# EAGLE design optoisolator-shield (EAGLE 6.5.0)
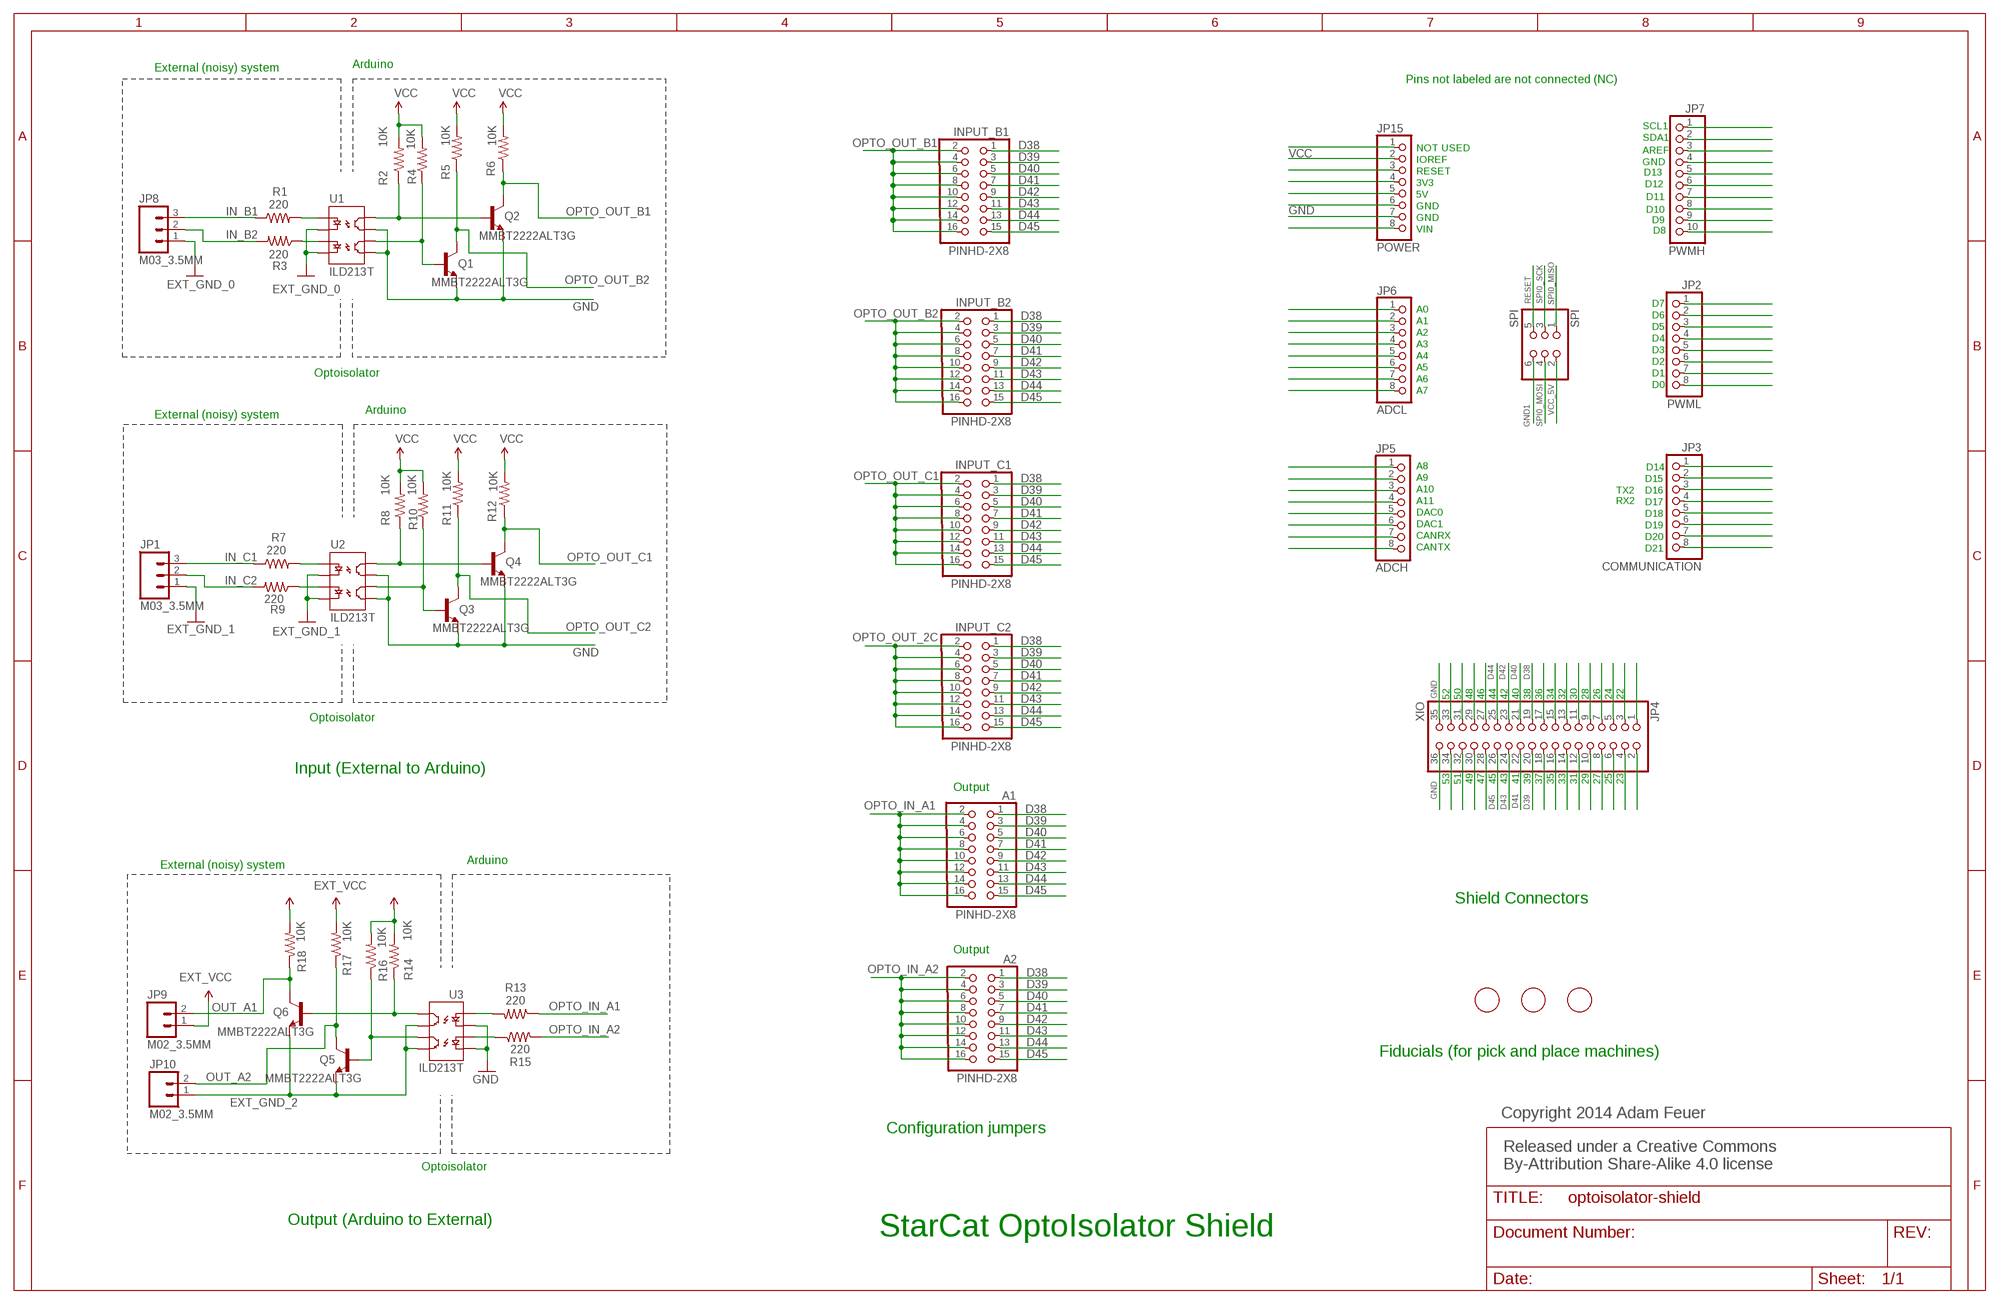
[diagram p0: schematic, sheet 1]

## Parts
A1  PINHD-2X8  [2X08]
A2  PINHD-2X8  [2X08]
INPUT_B1  PINHD-2X8  [2X08]
INPUT_B2  PINHD-2X8  [2X08]
INPUT_C1  PINHD-2X8  [2X08]
INPUT_C2  PINHD-2X8  [2X08]
JP1  M03_3.5MM  M03SCREW  [SCREWTERMINAL-3.5MM-3]
JP2  PWML  PINHD-1X8  [1X08]
JP3  COMMUNICATION  PINHD-1X8  [1X08]
JP4  XIO  PINHD-2X18  [2X18]
JP5  ADCH  PINHD-1X8  [1X08]
JP6  ADCL  PINHD-1X8  [1X08]
JP7  PWMH  PINHD-1X10  [1X10]
JP8  M03_3.5MM  M03SCREW  [SCREWTERMINAL-3.5MM-3]
JP9  M02_3.5MM  M023.5MM  [SCREWTERMINAL-3.5MM-2]
JP10  M02_3.5MM  M023.5MM  [SCREWTERMINAL-3.5MM-2]
JP15  POWER  PINHD-1X8  [1X08]
Q1  MMBT2222ALT3G  TRANSISTOR_NPNSOT23-3  [SOT23-3]
Q2  MMBT2222ALT3G  TRANSISTOR_NPNSOT23-3  [SOT23-3]
Q3  MMBT2222ALT3G  TRANSISTOR_NPNSOT23-3  [SOT23-3]
Q4  MMBT2222ALT3G  TRANSISTOR_NPNSOT23-3  [SOT23-3]
Q5  MMBT2222ALT3G  TRANSISTOR_NPNSOT23-3  [SOT23-3]
Q6  MMBT2222ALT3G  TRANSISTOR_NPNSOT23-3  [SOT23-3]
R1  220  RESISTOR0603-RES  [0603-RES]
R2  10K  RESISTOR0603-RES  [0603-RES]
R3  220  RESISTOR0603-RES  [0603-RES]
R4  10K  RESISTOR0603-RES  [0603-RES]
R5  10K  RESISTOR0603-RES  [0603-RES]
R6  10K  RESISTOR0603-RES  [0603-RES]
R7  220  RESISTOR0603-RES  [0603-RES]
R8  10K  RESISTOR0603-RES  [0603-RES]
R9  220  RESISTOR0603-RES  [0603-RES]
R10  10K  RESISTOR0603-RES  [0603-RES]
R11  10K  RESISTOR0603-RES  [0603-RES]
R12  10K  RESISTOR0603-RES  [0603-RES]
R13  220  RESISTOR0603-RES  [0603-RES]
R14  10K  RESISTOR0603-RES  [0603-RES]
R15  220  RESISTOR0603-RES  [0603-RES]
R16  10K  RESISTOR0603-RES  [0603-RES]
R17  10K  RESISTOR0603-RES  [0603-RES]
R18  10K  RESISTOR0603-RES  [0603-RES]
SPI  SPI  PINHD-2X3  [2X03]
U1  ILD213T  OPTOISOLATOR-2SOIC8  [SO08-2]
U2  ILD213T  OPTOISOLATOR-2SOIC8  [SO08-2]
U3  ILD213T  OPTOISOLATOR-2SOIC8  [SO08-2]
U$2  FIDUCIAL  [FIDUCIAL_1MM]
U$5  FIDUCIAL  [FIDUCIAL_1MM]
U$6  FIDUCIAL  [FIDUCIAL_1MM]

## Nets
D38: A1.1 A2.1 INPUT_B1.1 INPUT_B2.1 INPUT_C1.1 INPUT_C2.1 JP4.19
D39: A1.3 A2.3 INPUT_B1.3 INPUT_B2.3 INPUT_C1.3 INPUT_C2.3 JP4.20
D40: A1.5 A2.5 INPUT_B1.5 INPUT_B2.5 INPUT_C1.5 INPUT_C2.5 JP4.21
D41: A1.7 A2.7 INPUT_B1.7 INPUT_B2.7 INPUT_C1.7 INPUT_C2.7 JP4.22
D42: A1.9 A2.9 INPUT_B1.9 INPUT_B2.9 INPUT_C1.9 INPUT_C2.9 JP4.23
D43: A1.11 A2.11 INPUT_B1.11 INPUT_B2.11 INPUT_C1.11 INPUT_C2.11 JP4.24
D44: A1.13 A2.13 INPUT_B1.13 INPUT_B2.13 INPUT_C1.13 INPUT_C2.13 JP4.25
D45: A1.15 A2.15 INPUT_B1.15 INPUT_B2.15 INPUT_C1.15 INPUT_C2.15 JP4.26
EXT_GND_0: JP8.1 U1.2(C1) U1.4(C2)
EXT_GND_1: JP1.1 U2.2(C1) U2.4(C2)
EXT_GND_2: JP10.1 Q5.2(E) Q6.2(E) U3.5(EM2) U3.7(EM1)
EXT_VCC: JP9.1 R14.2 R16.2 R17.2 R18.2 ; supply symbol labelled EXTERNAL_VCC
GND: JP4.35 JP4.36 JP15.7 Q1.2(E) Q2.2(E) Q3.2(E) Q4.2(E) U1.5(EM2) U1.7(EM1) U2.5(EM2) U2.7(EM1) U3.2(C1) U3.4(C2)
GND1: SPI.6
IN_B1: JP8.3 R1.1
IN_B2: JP8.2 R3.2
IN_C1: JP1.3 R7.1
IN_C2: JP1.2 R9.2
N$1: JP7.9
N$2: JP5.1
N$3: JP15.1
N$4: JP3.7
N$5: JP2.7
N$6: R1.2 U1.1(A1)
N$7: JP7.3
N$8: JP7.4
N$9: JP7.5
N$10: JP7.6
N$11: JP7.7
N$12: JP7.10
N$13: JP2.1
N$14: JP2.2
N$15: JP2.3
N$16: JP2.5
N$17: JP2.6
N$18: JP2.8
N$19: JP3.1
N$20: R3.1 U1.3(A2)
N$21: R7.2 U2.1(A1)
N$22: JP3.2
N$23: R9.1 U2.3(A2)
N$24: R13.2 U3.1(A1)
N$25: JP3.5
N$26: JP3.6
N$27: R15.1 U3.3(A2)
N$32: JP3.8
N$37: JP5.8
N$43: JP5.7
N$44: JP5.6
N$55: JP5.5
N$56: JP5.4
N$57: JP5.3
N$58: JP5.2
N$65: JP6.4
N$66: JP6.3
N$68: JP6.2
N$69: JP15.8
N$71: JP15.6
N$72: JP15.3
N$73: JP4.34
N$74: JP4.32
N$89: JP4.18
N$91: JP4.16
N$92: JP4.10
N$93: JP4.3
N$94: JP4.9
N$96: JP4.15
N$97: JP4.17
N$109: JP4.31
N$110: JP6.6
N$112: JP6.7
N$114: JP15.5
N$115: JP4.1
N$116: JP4.2
N$569: JP6.8
N$571: JP15.4
N$572: JP6.1
N$573: JP6.5
N$574: JP7.1
N$575: JP7.2
N$576: JP7.8
N$577: JP2.4
N$578: JP3.3
N$579: JP3.4
N$580: JP4.5
N$581: JP4.7
N$582: JP4.11
N$583: JP4.13
N$584: JP4.27
N$585: JP4.29
N$586: JP4.33
N$587: JP4.4
N$588: JP4.6
N$589: JP4.8
N$590: JP4.12
N$591: JP4.14
N$592: JP4.30
N$601: JP4.28
OPTO_IN_A1: A1.2 A1.4 A1.6 A1.8 A1.10 A1.12 A1.14 A1.16 R13.1
OPTO_IN_A2: A2.2 A2.4 A2.6 A2.8 A2.10 A2.12 A2.14 A2.16 R15.2
OPTO_OUT_2C: INPUT_C2.2 INPUT_C2.4 INPUT_C2.6 INPUT_C2.8 INPUT_C2.10 INPUT_C2.12 INPUT_C2.14 INPUT_C2.16
OPTO_OUT_B1: INPUT_B1.2 INPUT_B1.4 INPUT_B1.6 INPUT_B1.8 INPUT_B1.10 INPUT_B1.12 INPUT_B1.14 INPUT_B1.16 Q2.3(C) R6.1
OPTO_OUT_B2: INPUT_B2.2 INPUT_B2.4 INPUT_B2.6 INPUT_B2.8 INPUT_B2.10 INPUT_B2.12 INPUT_B2.14 INPUT_B2.16 Q1.3(C) R5.1
OPTO_OUT_C1: INPUT_C1.2 INPUT_C1.4 INPUT_C1.6 INPUT_C1.8 INPUT_C1.10 INPUT_C1.12 INPUT_C1.14 INPUT_C1.16 Q4.3(C) R12.1
OPTO_OUT_C2: Q3.3(C) R11.1
OUT1N1: Q4.1(B) R8.1 U2.8(CL1)
OUT1N2: Q2.1(B) R2.1 U1.8(CL1)
OUT1N3: Q6.1(B) R14.1 U3.8(CL1)
OUT2N1: Q3.1(B) R10.1 U2.6(CL2)
OUT2N2: Q1.1(B) R4.1 U1.6(CL2)
OUT2N3: Q5.1(B) R16.1 U3.6(CL2)
OUT_A1: JP9.2 Q6.3(C) R18.1
OUT_A2: JP10.2 Q5.3(C) R17.1
RESET: SPI.5
SPI0_MISO: SPI.1
SPI0_MOSI: SPI.4
SPI0_SCK: SPI.3
VCC: JP15.2 R2.2 R4.2 R5.2 R6.2 R8.2 R10.2 R11.2 R12.2
VCC_5V: SPI.2

## Notes on the sheet
- Arduino
- External (noisy) system
- Pins not labeled are not connected (NC)
- SCL1
- SDA1
- NOT USED | AREF
- IOREF | GND
- RESET | D13
- 3V3 | D12
- 5V | D11
- GND
- D10
- GND | D9
- VIN | D8
- D7
- A0
- D6
- A1
- D5
- A2
- D4
- A3
- D3
- A4
- D2
- A5
- Optoisolator | D1
- A6
- D0
- A7
- Arduino
- External (noisy) system
- A8 | D14
- A9 | D15
- A10 | TX2 | D16
- A11 | RX2 | D17
- DAC0 | D18
- DAC1 | D19
- CANRX | D20
- CANTX | D21
- 52 | 50 | 48 | 46 | 44 | 42 | 40 | 38 | 36 | 34 | 32 | 30 | 28 | 26 | 24 | 22
- Optoisolator
- Input (External to Arduino)
- 53 | 51 | 49 | 47 | 45 | 43 | 41 | 39 | 37 | 35 | 33 | 31 | 29 | 27 | 25 | 23
- Output
- Arduino
- External (noisy) system
- Shield Connectors
- Output
- Fiducials (for pick and place machines)
- Copyright 2014 Adam Feuer
- Configuration jumpers
- Released under a Creative Commons 
  By-Attribution Share-Alike 4.0 license
- Optoisolator
- Output (Arduino to External)
- StarCat OptoIsolator Shield

## Library data of the parts
A1 A2 INPUT_B1 INPUT_B2 INPUT_C1 INPUT_C2 = headers:PINHD-2X8
JP1 JP8 = SparkFun-Connectors:M03: Header 3 Standard 3-pin 0.1" header. Use with straight break away headers (SKU : PRT-00116), right angle break away headers (PRT-00553), swiss pins (PRT-00743), machine pins (PRT-00117), and female headers (PRT-00115). Molex polarized connector foot print use with SKU : PRT-08232 with associated crimp pins and housings.
JP2 JP3 JP5 JP6 JP15 = SmartPrj:PINHD-1X8: PIN HEADER
JP4 = SmartPrj:PINHD-2X18: PIN HEADER
JP7 = SmartPrj:PINHD-1X10: PIN HEADER
JP9 JP10 = SparkFun-Connectors:M02: Standard 2-pin 0.1" header. Use with - straight break away headers ( PRT-00116) - right angle break away headers (PRT-00553) - swiss pins (PRT-00743) - machine pins (PRT-00117) - female headers (PRT-00115) Molex polarized connector foot print use with: PRT-08233 with associated crimp pins and housings. 2.54_SCREWTERM for use with PRT-10571. 3.5mm Screw Terminal footprints for PRT-08084 5mm Screw Terminal footprints for use with PRT-08433
Q1-Q6 = SparkFun:TRANSISTOR_NPN: Transistor NPN BJT configuration in SOT23 package. MMBT2222 is the common NPN we use. Double check BCE configuration again layout.
R1-R18 = SparkFun-Passives:RESISTOR: Resistor Basic schematic elements and footprints for 0603, 1206, and PTH resistors.
SPI = SmartPrj:PINHD-2X3: PIN HEADER
U1-U3 = SparkFun:OPTOISOLATOR-2: Description: Dual gate opto isolator. Vishay part : ILD213T
U$2 U$5 U$6 = adafruit:FIDUCIAL: For use by pick and place machines to calibrate the vision/machine, 1mm By microbuilder.eu

## Board
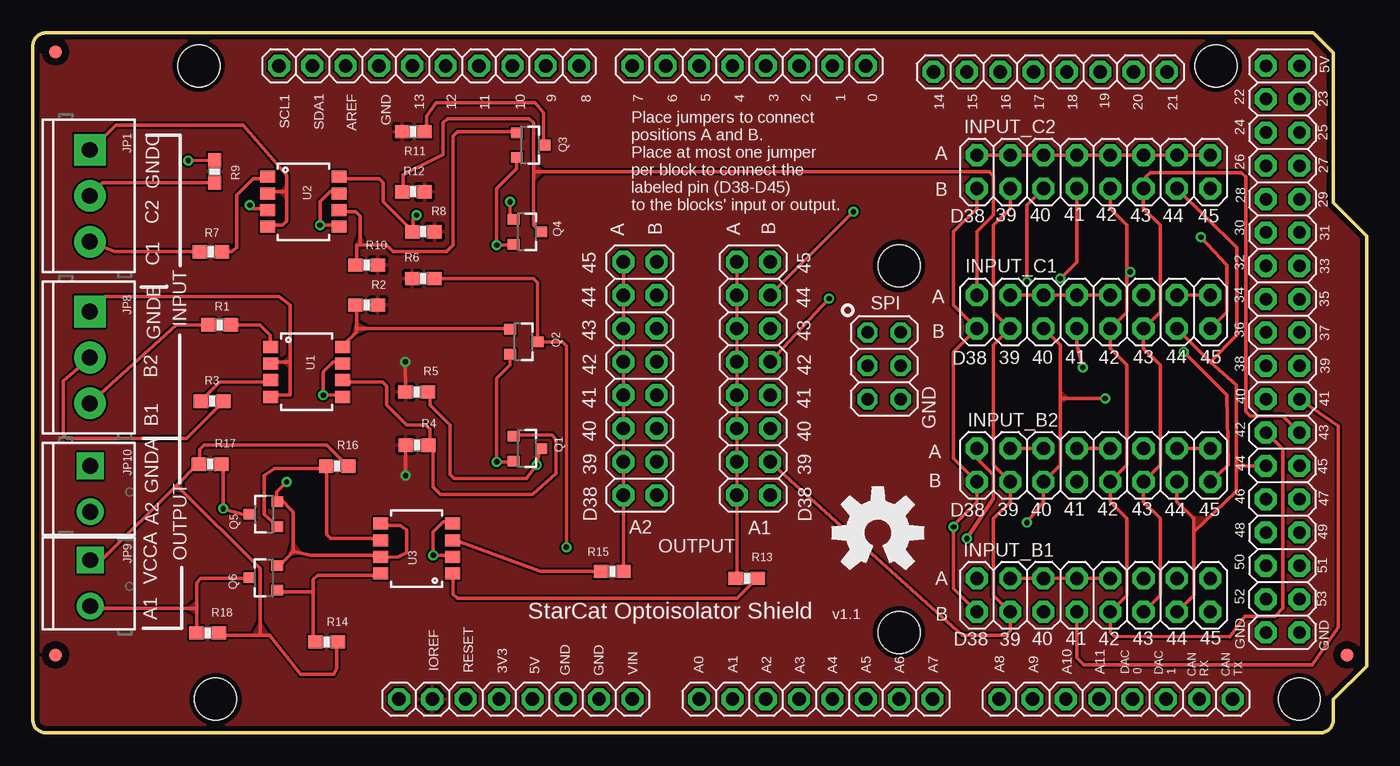
[diagram p1: board, top side]
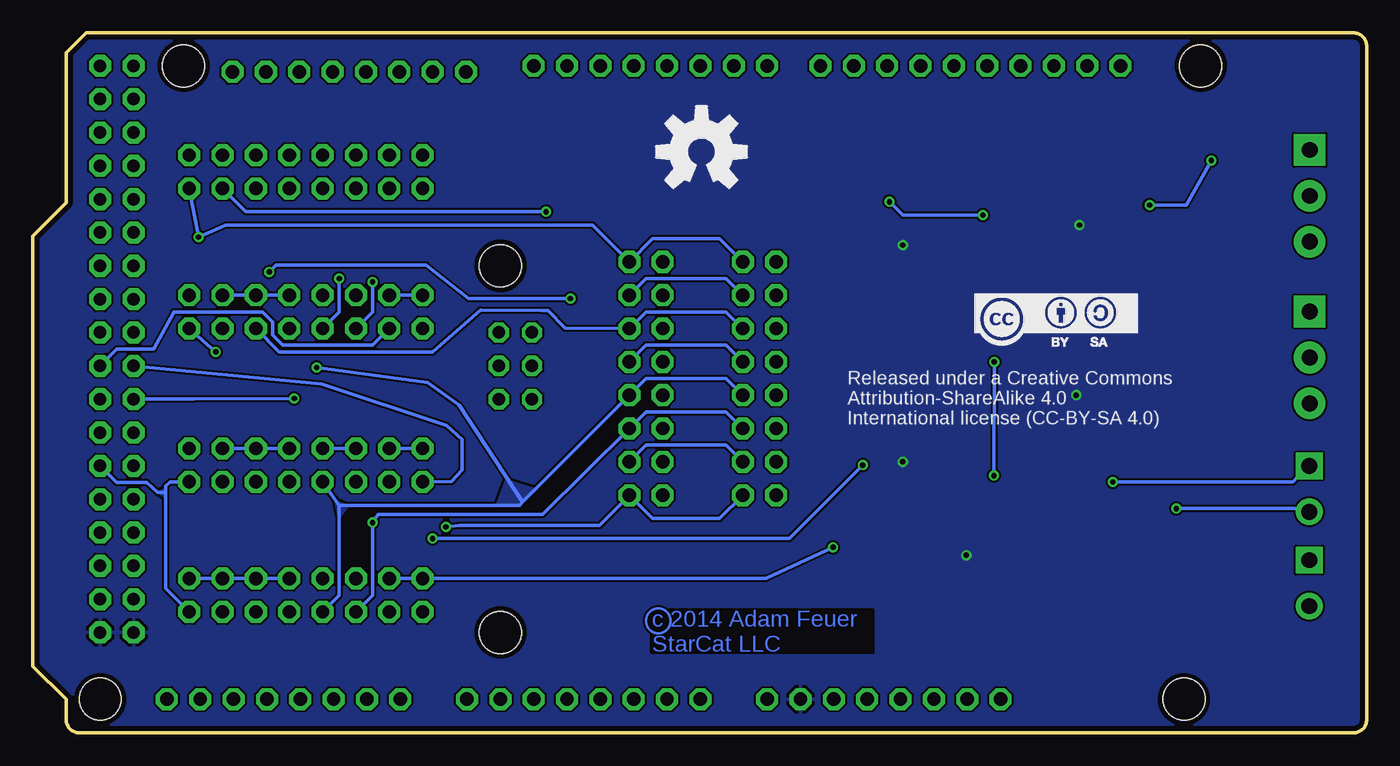
[diagram p2: board, bottom side, seen from below]

Size 101.6 x 53.34 mm. Coordinates in mm from the lower left corner, seen from the top.
Outline: 97.54,53.34 99.06,51.82 99.06,40.39 101.6,37.85 101.6,5.08 99.06,2.54 99.06,1 arc-90 98.06,0 1,0 arc-90 0,1 0,52.34 arc-90 1,53.34 97.54,53.34
Copper layers (1*16): Top 0.0356mm / dielectric 1.5011mm / Bottom 0.0356mm
Design rules "LaenPCBOrder": minimum track width 6mil, minimum drill 13mil, track to track 6mil, track to pad 6mil, pad to pad 6mil, via to via 6mil, smd to smd 6mil, copper to edge 15mil, drill to drill 6mil, minimum pad ring 7mil, minimum via ring 7mil, stop-mask expansion 3mil, vias tented up to drill 0mil, thermal gap 10mil
Holes 3.2 mm at 96.47,2.57 12.65,50.83 90.12,50.83 13.92,2.57 65.99,35.59 65.99,7.65

### Footprints (pad centres in the part's own frame; a part is rotated, then mirrored left to right if it is on the bottom)
2X08 = drill 1.016 pad 1.676 octagon: 1 -8.89,-1.27; 2 -8.89,1.27; 3 -6.35,-1.27; 4 -6.35,1.27; 5 -3.81,-1.27; 6 -3.81,1.27; 7 -1.27,-1.27; 8 -1.27,1.27; 9 1.27,-1.27; 10 1.27,1.27; 11 3.81,-1.27; 12 3.81,1.27; 13 6.35,-1.27; 14 6.35,1.27; 15 8.89,-1.27; 16 8.89,1.27
SCREWTERMINAL-3.5MM-3 = drill 1.2 pad 2.413 square: 1 0,0 | drill 1.2 pad 2.413: 2 3.5,0; 3 7,0
1X08 = drill 1.016 pad 1.676 octagon: 1 -8.89,0; 2 -6.35,0; 3 -3.81,0; 4 -1.27,0; 5 1.27,0; 6 3.81,0; 7 6.35,0; 8 8.89,0
2X18 = drill 0.95 pad 1.676 octagon: 1 -21.59,-1.27; 2 -21.59,1.27; 3 -19.05,-1.27; 4 -19.05,1.27; 5 -16.51,-1.27; 6 -16.51,1.27; 7 -13.97,-1.27; 8 -13.97,1.27; 9 -11.43,-1.27; 10 -11.43,1.27; 11 -8.89,-1.27; 12 -8.89,1.27; 13 -6.35,-1.27; 14 -6.35,1.27; 15 -3.81,-1.27; 16 -3.81,1.27; 17 -1.27,-1.27; 18 -1.27,1.27; 19 1.27,-1.27; 20 1.27,1.27; 21 3.81,-1.27; 22 3.81,1.27; 23 6.35,-1.27; 24 6.35,1.27; 25 8.89,-1.27; 26 8.89,1.27; 27 11.43,-1.27; 28 11.43,1.27; 29 13.97,-1.27; 30 13.97,1.27; 31 16.51,-1.27; 32 16.51,1.27; 33 19.05,-1.27; 34 19.05,1.27; 35 21.59,-1.27; 36 21.59,1.27
1X10 = drill 1.016 pad 1.676 octagon: 1 -11.43,0; 2 -8.89,0; 3 -6.35,0; 4 -3.81,0; 5 -1.27,0; 6 1.27,0; 7 3.81,0; 8 6.35,0; 9 8.89,0; 10 11.43,0
SCREWTERMINAL-3.5MM-2 = drill 1.2 pad 2.032 square: 1 0,0 | drill 1.2 pad 2.032: 2 3.5,0
SOT23-3 = smd 0.8 x 0.9: 1 -0.95,-1; 2 0.95,-1; 3 0,1.1
0603-RES = smd 1.1 x 1: 1 -0.85,0; 2 0.85,0
2X03 = drill 0.95 pad 1.55 octagon: 1 -2.54,-1.27; 2 -2.54,1.27; 3 0,-1.27; 4 0,1.27; 5 2.54,-1.27; 6 2.54,1.27
SO08-2 = smd 0.914 x 1.143: 1 -1.905,-2.731; 2 -0.635,-2.731; 3 0.635,-2.731; 4 1.905,-2.731; 5 1.905,2.731; 6 0.635,2.731; 7 -0.635,2.731; 8 -1.905,2.731
FIDUCIAL_1MM = smd 1 x 1: 1 0,0

### Placement (x,y rotation side)
A1  54.89,27 90 top
A2  46.25,27 90 top
INPUT_B1  80.8,10.49 0 top
INPUT_B2  80.8,20.4 0 top
INPUT_C1  80.8,32.08 0 top
INPUT_C2  80.8,42.75 0 top
JP1  4.34,44.42 270 top
JP2  54.56,50.83 0 top
JP3  77.5,50.37 0 top
JP4  95.2,29.24 270 top
JP5  82.5,2.57 0 top
JP6  59.64,2.57 0 top
JP7  30.18,50.83 0 top
JP8  4.34,32.11 270 top
JP9  4.37,13.16 270 top
JP10  4.37,20.35 270 top
JP15  36.78,2.57 0 top
Q1  37.62,21.67 270 top
Q2  37.36,29.79 270 top
Q3  37.87,44.78 270 top
Q4  37.62,38.18 270 top
Q5  17.63,16.66 90 top
Q6  17.6,11.81 90 top
R1  14.22,31.09 0 top
R2  25.43,32.59 0 top
R3  13.67,25.27 0 top
R4  29.26,21.92 180 top
R5  29.24,25.98 180 top
R6  29.74,34.62 180 top
R7  13.56,36.65 0 top
R8  29.74,38.18 0 top
R9  13.84,42.77 270 top
R10  25.43,35.64 0 top
R11  28.98,45.8 180 top
R12  28.98,41.22 0 top
R13  54.38,11.76 0 top
R14  22.38,6.93 0 top
R15  44.15,12.29 0 top
R16  23.19,20.32 0 top
R17  13.51,20.47 180 top
R18  13.31,7.62 0 top
SPI  64.85,27.97 270 top
U1  20.85,27.51 270 top
U2  20.6,40.46 270 top
U3  29.24,14.05 90 top
U$1  [OSHW-LOGO-L]  64.36,15.24 0 top
U$2  1.73,51.89 0 top
U$3  [OSHW-LOGO-L]  50.67,44.27 0 bottom
U$4  [CC-BY-SA]  30,29.16 0 bottom
U$5  1.73,5.94 0 top
U$6  100.1,5.94 0 top

### Tracks (layer width: path | path; a pad name or v marks a point on that pad's centre or on a via)
D38  (via drill 0.41)
  Top 0.254: INPUT_C2.1 71.91,39.95 70.13,38.18 70.13,32.59 INPUT_C1.1 70.13,29.03 70.13,20.9 INPUT_B2.1 71.91,17.6 70.13,15.82 v70.13,15.7 70.13,11 INPUT_B1.1
  Bottom 0.254: A2.1 49.3,16.33 54.38,16.33 A1.1 58.45,15.82 69.09,15.82 v70.13,15.7 | INPUT_B2.1 69.71,19.15 68.89,20.03 68.89,22.35 70.08,23.42 79.6,26.59 JP4.19
D39
  Top 0.254: INPUT_C2.3 74.45,39.95 73.18,38.68 73.18,32.08 INPUT_C1.3 73.18,29.54 73.18,20.4 INPUT_B2.3 74.45,17.6 73.18,16.33 73.18,10.49 INPUT_B1.3 74.45,7.76 74.13,7.44 70.79,7.44 A1.3
  Bottom 0.152: 90.88,32.03 90.88,32.08
  Bottom 0.254: 90.88,32.08 84.1,32.08 83.34,31.32 83.34,30.3 82.58,29.54 75.72,29.54 INPUT_C1.3 | A2.3 48.79,21.92 54.89,21.92 A1.3 | JP4.20 95.2,29.24 92.41,29.24 90.88,32.03
D40  (via drill 0.41)
  Top 0.254: v75.72,16.03 76.99,17.6 INPUT_B2.5 78.26,20.4 78.26,25.48 | INPUT_C1.5 78.26,29.54 78.26,25.48 | INPUT_C2.5 75.72,40.21 v75.72,34.37 | 78.26,25.48 v81.69,25.48
  Bottom 0.254: A2.5 48.79,24.46 54.89,24.46 A1.5 62.76,16.66 75.29,16.64 v75.72,16.03 75.72,10.49 INPUT_B1.5 | INPUT_C1.5 75.72,32.08 v75.72,34.37 | JP4.21 89.36,25.45 v81.69,25.48
  pour Top: 78.26,26.11 78.94,25.48 78.23,25.04
D41  (via drill 0.41)
  Top 0.254: v78.26,34.62 79.53,35.89 INPUT_C2.7 | v79.98,27.84 79.53,29.54 INPUT_C1.7 | JP4.22 99.44,23.37 99.44,8.03 97.46,5.18 80.07,5.18 79.53,5.7 INPUT_B1.7
  Bottom 0.254: INPUT_C1.7 78.26,32.08 v78.26,34.62 | A2.7 48.79,27 54.89,27 A1.7 64.29,17.6 | INPUT_B1.7 78.26,10.49 78.26,17.35 | 64.29,17.6 64.54,17.35 78.26,17.35 | v79.98,27.84 71.53,26.7 69.14,24.97 64.29,17.6 | INPUT_B2.7 78.26,17.35
  pour Bottom: 65.56,19.35 63.17,18.59 64.54,17.3 66.32,17.32
  pour Bottom: 77.5,17.35 78.31,16.28 78.61,17.81
D42  (via drill 0.41)
  Top 0.254: 83.34,35.13 83.34,38.68 82.07,39.95 INPUT_C2.9 | 83.34,35.13 83.34,32.08 INPUT_C1.9 82.07,29.29 83.34,28.02 83.34,20.4 INPUT_B2.9 82.07,17.6 83.34,16.33 83.34,10.49 INPUT_B1.9 82.07,7.66 82.38,7.34 91.16,7.32 92.33,8.86 94.64,8.86 95.22,9.47 95.2,21.62 JP4.23 | 83.34,35.13 v83.59,35.13 | v60.66,33.1 A1.9
  Bottom 0.254: A2.9 48.79,29.54 54.89,29.54 A1.9 | v60.66,33.1 68.4,33.1 71.65,35.64 83.08,35.64 v83.59,35.13
D43
  Top 0.254: INPUT_B1.11 85.88,10.49 85.88,16.33 84.61,17.6 INPUT_B2.11 85.88,20.4 85.88,28.02 84.61,29.29 INPUT_C1.11 85.88,32.08 85.88,38.68 84.61,39.95 INPUT_C2.11 84.79,41.68 84.79,42.38 85.1,42.7 92.06,42.7 92.38,42.38 92.38,24.5 92.75,24.16 95.2,24.16 JP4.24
  Bottom 0.254: A2.11 48.79,32.08 54.89,32.08 A1.11 61.06,30.86 62.36,32.18 62.81,32.18 67.49,32.21 71.15,29.03 82.83,29.03 INPUT_C1.11
D44  (via drill 0.41)
  Top 0.254: INPUT_B1.13 88.42,10.49 88.42,15.32 | 88.42,15.32 88.42,16.33 87.15,17.6 INPUT_B2.13 | 89.69,28.27 91.67,26.49 91.67,20.35 | 89.69,28.27 INPUT_C1.13 | 91.67,20.35 91.67,18.39 88.42,15.32 | INPUT_C2.13 91.69,36.98 91.69,30.3 89.69,28.27 | v62.51,39.7 A1.13 | 91.67,20.35 JP4.25
  Bottom 0.254: A2.13 48.79,34.62 54.89,34.62 A1.13 | v62.51,39.7 85.37,39.7 INPUT_C2.13
  pour Top: 88.21,16.59 89.61,16.46 88.54,15.39
  pour Top: 91.62,21.18 92.35,20.35 91.64,19.79
D45  (via drill 0.41)
  Top 0.254: INPUT_C1.15 90.96,32.08 90.96,35.64 v88.98,37.77 | INPUT_B2.15 91.06,20.4 90.96,25.73 v87.66,29.03
  Bottom 0.254: INPUT_B1.15 91.47,11 91.47,18.31 | INPUT_B2.15 91.15,19.13 91.47,18.81 91.47,18.31 | A2.15 49.3,37.67 54.38,37.67 A1.15 58.95,38.68 86.89,38.68 v88.98,37.77 INPUT_C2.15 | JP4.26 95.2,19.08 92.91,19.08 92.08,18.34 91.47,18.31 | INPUT_C1.15 v87.66,29.03
  pour Bottom: 91.47,18.72 91.44,17.83 92.15,18.36
EXT_GND_0
  Top 0.254: 19.58,28.27 19.58,25.73 18.31,25.73 U1.4 | U1.2 18.31,28.27 19.58,28.27 | 19.58,28.27 19.58,32.61 18.77,33.25 5.52,33.25 JP8.1
  pour Top: 18.97,28.27 19.61,28.83 19.61,27.69
EXT_GND_1
  Top 0.254: 19.33,41.22 19.33,39 19.01,38.68 18.06,38.68 U2.4 | U2.2 18.06,41.22 19.33,41.22 | 19.33,41.22 19.33,42.49 16.03,46.3 6.31,46.3 4.43,44.42 JP1.1
  pour Top: 19.35,41.86 18.72,41.2 19.35,40.56
EXT_GND_2  (via drill 0.41)
  Top 0.254: 19.84,13.82 18.82,12.78 Q6.2 | 19.84,13.82 19.84,16.84 18.82,17.86 Q5.2 18.57,17.86 18.57,18.36 v19.33,19.13 | 19.84,13.82 19.84,13.79 | 19.84,13.82 21.21,13.54 26.44,13.54 U3.7 26.67,13.39 27.82,13.39 28.48,13.71 28.47,15.48 27.98,15.82 26.7,15.82 U3.5
  Bottom 0.254: v19.33,19.13 5.61,19.13 4.6,20.14 JP10.1
  pour Top: 19.79,14.6 20.57,13.64 19.48,13.46
EXT_VCC
  Top 0.254: 17.3,7.44 18.05,7.44 20.4,4.45 22.9,4.45 23.14,4.91 23.14,6.93 R14.2 | 17.3,7.44 14.25,7.44 R18.2 | 10.95,18.87 5.36,13.28 4.6,13.28 JP9.1 | 10.95,18.87 12.47,20.4 R17.2 12.73,20.65 12.73,21.6 13.04,21.92 22.38,21.92 23.9,20.4 R16.2 | 17.3,7.44 17.3,12.52 10.95,18.87
  pour Top: 17.27,8.56 16.69,7.44 18.03,7.42
  pour Top: 11.33,19.3 10.52,18.49 11.46,18.34
GND  (via drill 0.41)
  Top 0.254: Q1.2 36.6,20.65 v35.33,20.65 35.33,27 36.35,28.02 36.35,28.78 Q2.2 | Q4.2 36.6,37.16 v35.33,37.16 35.33,41.48 36.86,43 36.86,43.76 Q3.2 | U3.2 31.78,13.54 v30.51,13.54 30.51,15.32 31.27,16.08 31.78,16.08 U3.4 | U1.5 23.39,25.73 v22.12,25.73 22.12,27.51 22.89,28.27 23.39,28.27 U1.7 | U2.5 23.14,38.68 v21.87,38.68 21.87,40.46 22.63,41.22 23.14,41.22 U2.7
  pour Bottom (rank 3): 0.03,52.4 0.03,1.09 arc90 1.04,0.08 98.07,0.08 arc90 99.09,1.09 99.09,2.36 101.63,4.9 101.63,37.92 99.09,40.46 99.09,51.89 97.56,53.42 1.04,53.42 arc90
IN_B1
  Top 0.254: R1.1 10.91,31.09 JP8.3
IN_B2
  Top 0.025: JP8.2 4.52,28.73
  Top 0.254: R3.2 14.5,25.22 11.71,22.43 2.63,22.43 2.31,22.75 2.31,26.8 4.52,28.73
IN_C1
  Top 0.254: R7.1 6.22,36.65 JP1.3
IN_C2
  Top 0.254: R9.2 5.34,41.92 JP1.2
N$6
  Top 0.254: R1.2 16.08,31.06 17.3,31.06 18.06,30.3 18.06,29.54 U1.1
N$20
  Top 0.254: R3.1 12.98,25.48 14.25,26.75 18.06,26.75 U1.3
N$21
  Top 0.254: R7.2 15.15,36.65 15.52,36.97 15.52,40.97 16.79,42.24 17.81,42.24 U2.1
N$23  (via drill 0.41)
  Top 0.254: v16.54,40.21 16.79,39.95 17.81,39.95 U2.3 | R9.1 v11.84,43.61
  Bottom 0.254: v11.84,43.61 13.74,40.21 v16.54,40.21
N$24
  Top 0.254: R13.2 55.14,11.76 53.62,10.24 32.35,10.24 32.03,10.55 32.03,12.01 U3.1
N$27
  Top 0.254: R15.1 38.66,12.29 32.54,14.55 32.03,14.55 U3.3
OPTO_IN_A1
  Top 0.254: A1.16 A1.14 A1.12 A1.10 A1.8 A1.6 A1.4 A1.2 53.62,11.76 R13.1
OPTO_IN_A2
  Top 0.254: A2.16 A2.14 A2.12 A2.10 A2.8 A2.6 A2.4 A2.2 44.98,14.05 R15.2
OPTO_OUT_2C
  Top 0.254: INPUT_C2.16 INPUT_C2.14 INPUT_C2.12 INPUT_C2.10 INPUT_C2.8 INPUT_C2.6 INPUT_C2.4 INPUT_C2.2 71.91,44.46 71.59,44.78
OPTO_OUT_B1  (via drill 0.41)
  Top 0.254: 38.38,29.79 Q2.3 | INPUT_B1.4 INPUT_B1.6 INPUT_B1.8 INPUT_B1.10 | v40.64,14.15 40.67,29.48 40.35,29.79 Q2.3 | R6.1 38.15,34.62 38.46,34.3 Q2.3
  Bottom 0.254: INPUT_B1.4 INPUT_B1.2 45.75,11.76 v40.64,14.15 | INPUT_B1.10 INPUT_B1.12 INPUT_B1.14 INPUT_B1.16
OPTO_OUT_B2  (via drill 0.41)
  Top 0.254: Q1.3 38.63,21.67 v38.38,20.4 37.62,19.38 32.09,19.38 31.78,19.7 31.78,23.44 30.25,24.97 30.25,25.98 R5.1 | INPUT_B2.4 INPUT_B2.6 | INPUT_B2.16 INPUT_B2.14 | INPUT_B2.10 INPUT_B2.8 | INPUT_B2.2 71.65,21.41 71.65,21.16 73.18,19.63 73.18,17.86 v71.15,14.81
  Bottom 0.254: INPUT_B2.4 INPUT_B2.2 | INPUT_B2.10 INPUT_B2.12 INPUT_B2.14 | INPUT_B2.8 INPUT_B2.6 | v38.38,20.4 43.97,14.81 v71.15,14.81
OPTO_OUT_C1
  Top 0.254: 38.13,42.75 38.13,46.49 37.81,46.81 31.59,46.81 31.27,46.49 31.27,44.07 28.22,42.55 28.22,41.22 R12.1 | 38.13,42.75 38.13,38.68 38.63,38.18 Q4.3 | INPUT_C1.16 INPUT_C1.14 | INPUT_C1.4 INPUT_C1.6 INPUT_C1.8 INPUT_C1.10 | 38.13,42.75 72.86,42.75 73.18,42.43 73.18,39.45 71.91,38.18 INPUT_C1.2
  Bottom 0.254: INPUT_C1.4 INPUT_C1.2 | INPUT_C1.10 INPUT_C1.12 INPUT_C1.14
  pour Top (isolate 0.254): 38.13,43.51 38.13,41.99 38.89,42.75
OPTO_OUT_C2
  Top 0.254: Q3.3 38.89,44.78 38.89,47.27 38.25,48.03 30.72,48.03 30,47 30,45.8 R11.1
OUT1N1  (via drill 0.41)
  Top 0.254: v36.35,40.46 36.35,39.45 36.6,39.19 Q4.1 | v29.24,39.45 28.98,39.19 28.98,38.18 R8.1 28.73,38.18 28.73,38.43 26.7,40.46 26.7,41.92 26.38,42.24 23.39,42.24 U2.8
  Bottom 0.254: v36.35,40.46 35.33,39.45 v29.24,39.45
OUT1N2
  Top 0.254: 24.66,30.81 36.35,30.81 Q2.1 | 24.66,30.81 24.66,32.59 R2.1 | 24.66,30.81 24.66,30.56 23.65,29.54 U1.8
  pour Top: 24.61,31.39 25.68,30.81 24.31,30.2
OUT1N3
  Top 0.254: 21.36,10.74 18.82,10.74 Q6.1 | 21.36,10.74 21.36,6.93 R14.1 | 21.36,10.74 21.36,11.7 21.68,12.01 26.44,12.01 U3.8
OUT2N1
  Top 0.254: 24.92,37.16 24.66,37.16 24.66,35.64 R10.1 | 24.92,37.16 26.95,37.16 27.46,36.65 31.52,36.65 32.03,37.16 32.03,45.48 32.35,45.8 36.86,45.8 Q3.1 | 24.92,37.16 24.92,39.38 24.6,39.7 23.39,39.7 U2.6
  pour Top (isolate 0.254): 24.94,38.07 24.56,37.16 25.4,37.16
OUT2N2
  Top 0.254: Q1.1 36.86,22.68 39.54,22.68 39.85,22.36 39.85,19.76 38.05,18.16 31.05,18.16 30.51,18.73 30.51,21.92 R4.1 30.25,21.92 30.25,23.13 29.93,23.44 28.47,23.44 26.95,24.97 26.95,26.43 26.63,26.75 23.65,26.75 U1.6
OUT2N3
  Top 0.254: Q5.1 18.57,15.82 17.63,16.64 17.63,19.61 18.42,20.14 22.12,20.14 R16.1 22.38,20.14 22.38,15.13 22.7,14.81 26.44,14.81 U3.6
OUT_A1
  Top 0.254: 12.47,9.47 12.47,11.44 12.79,11.76 16.28,11.76 Q6.3 | 12.47,9.47 12.47,7.7 R18.1 | 12.47,9.47 4.6,9.47 JP9.2
  pour Top: 12.5,10.08 12.52,8.94 11.68,9.47
OUT_A2  (via drill 0.41)
  Top 0.254: Q5.3 16.28,16.59 14.5,17.07 v14.5,17.09 14.5,20.4 R17.1
  Bottom 0.254: v14.5,17.09 4.6,17.09 JP10.2
VCC  (via drill 0.41)
  Top 0.254: R5.2 v28.37,28.27 | v28.4,19.61 R4.2
  Bottom 0.254: v28.37,28.27 v28.4,19.61
  pour Top (rank 3): 0.99,0 98.04,0 arc90 99.06,1.02 99.06,2.59 101.6,5.08 101.6,37.82 99.06,40.39 99.06,51.79 97.54,53.37 1.12,53.37 arc90 -0.03,52.22 0,1.35 0,0.99 arc90
(copper drawn outside any net)
  shapes: Bottom circle x1

### Text on the board
Bottom: c 2014 Adam Feuer / StarCat LLC
tPlace: 5V | SCL1 | SDA1 | AREF | GND | 13 | 12 | 11 | 10 | 9 | 8 | 7 | 6 | 5 | 4 | 3 | 2 | 1 | 0 | 14 | 15 | 16 | 17 | 18 | 19 | 20 | 21 | 22 | 23 | 24 | 25 | A | 26 | 27 | 28 | GNDC | B | Place jumpers to connect / positions A and B. / Place at most one jumper / per block to connect the / labeled pin (D38-D45) / to the blocks' input or output. | 29 | C2 | D38 | 39 | 40 | 41 | 42 | 43 | 44 | 45 | 30 | A | B | A | B | 31 | C1 | 32 | 45 | 45 | 33 | 34 | A | 44 | 44 | 35 | INPUT | 36 | GNDB | 43 | 43 | B | 37 | 38 | D38 | 39 | 40 | 41 | 42 | 43 | 44 | 45 | B2 | 42 | 42 | 39 | 40 | 41 | 41 | 41 | 42 | B1 | GND | 40 | 40 | 43 | A | 44 | 39 | 39 | 45 | B | 46 | GNDA | 41 | 42 | 43 | 47 | A2 | D38 | D38 | D38 | 39 | 40 | 44 | 45 | 48 | OUTPUT | 49 | 50 | OUTPUT | 51 | VCCA | A | 52 | StarCat Optoisolator Shield | 53 | A1 | v1.1 | B | GND | GND | D38 | 39 | 40 | 41 | 42 | 43 | 44 | 45 | IOREF | RESET | 3V3 | A0 | A1 | A2 | A5 | A6 | A7 | A8 | A9 | 5V | GND | GND | VIN | A3 | A4 | A10 | A11 | DAC / 0 | DAC / 1 | CAN / RX | CAN / TX
bPlace: Released under a Creative Commons / Attribution-ShareAlike 4.0 / International license (CC-BY-SA 4.0)